# Altium schematic sheet 13. Others.SchDoc
size A4; CheckedBy: 黄钦宁; Author: 陈坤; DocumentNumber: 13; SheetNumber: 13; SheetTotal: 13; PageSetup: Record=PageOptions|CenterHorizontal=True|CenterVertical=True|PrintScale=1.00|XCorrection=1.00|YCorrection=1.00|PrintKind=0|BorderSize=5000000|LeftOffset=0|BottomOffset=0|Orientation=2|PaperLength=1000|PaperWidth=1000|Scale=100|PaperSource=7|PrintQuality=600|MediaType=1|DitherType=10|PaperKind=A4|PrintScaleMode=1; DesignDate: 2013-08-16; CheckDate: 2013-12-28; SheetName: Others; SheetVersion: V1.00; SheetDescription: 复位、模式配置、排针接口; ProductName: EasyARM-iMX28学习套件; ProductModel: EasyARM-iMX283
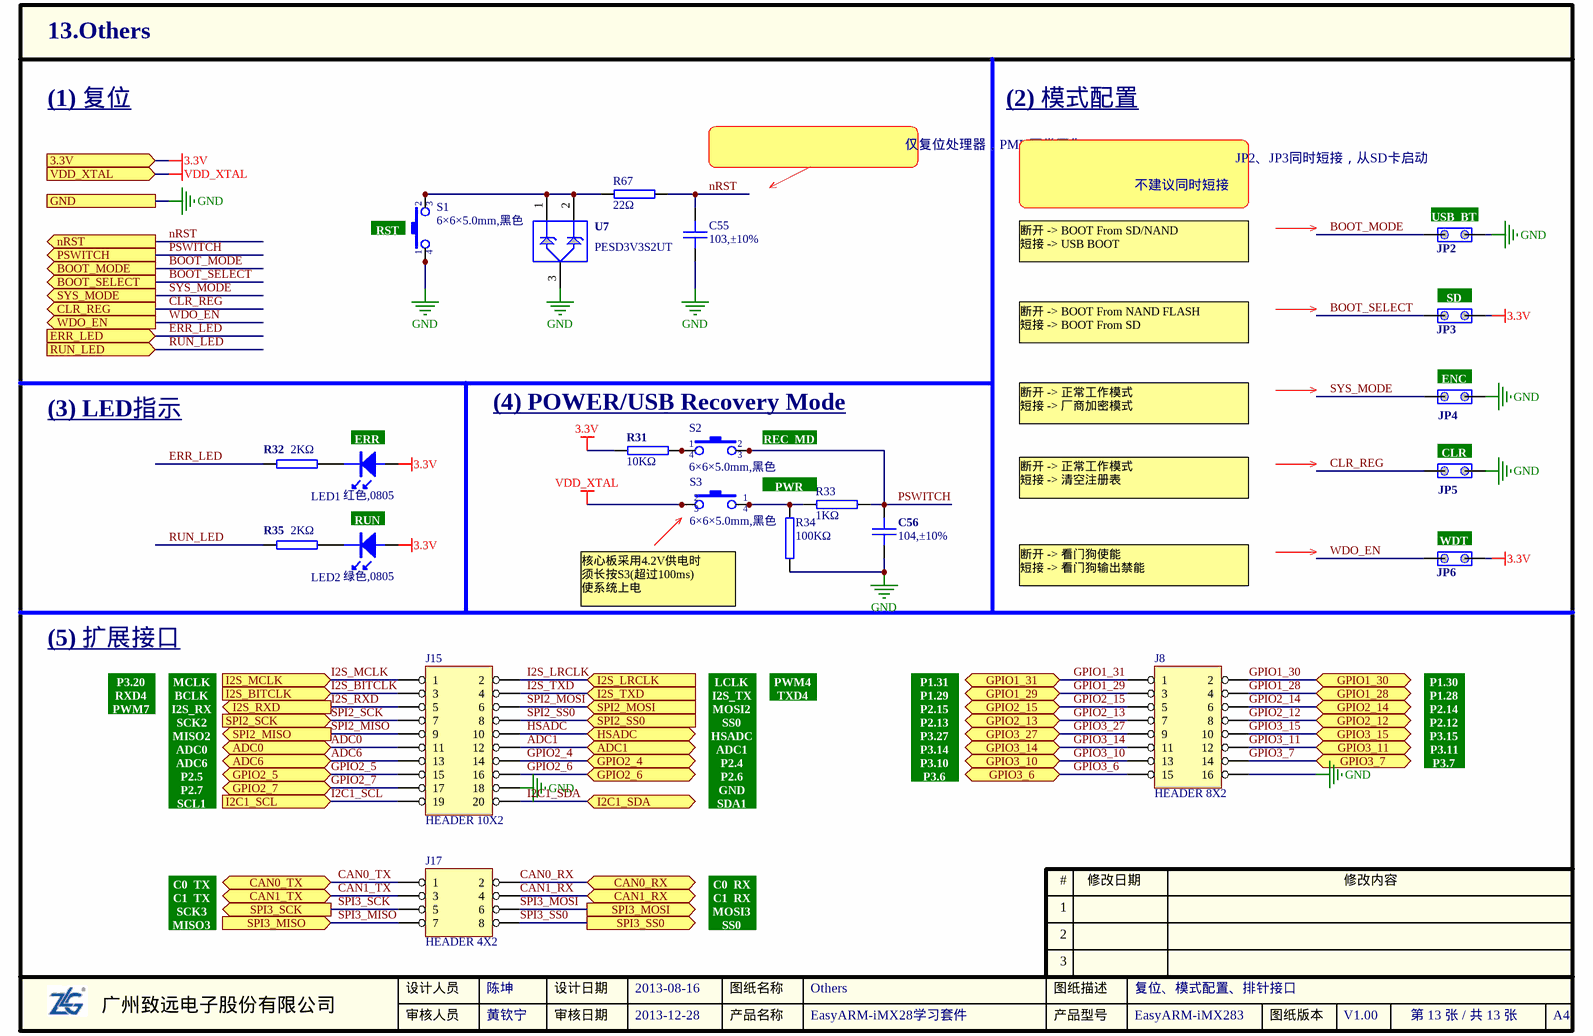
[diagram p0: 13. Others.SchDoc]

## Parts
C55  103,±10%  [0603C]
C56  104,±10%  [0603C]
J8  HEADER 8X2  [IDC-16]
J15  HEADER 10X2  [IDC-20]
J17  HEADER 4X2  [IDC-8]
JP2  120Ω_EN  [SIP-2]  (value not drawn)
JP3  120Ω_EN  [SIP-2]  (value not drawn)
JP4  120Ω_EN  [SIP-2]  (value not drawn)
JP5  120Ω_EN  [SIP-2]  (value not drawn)
JP6  120Ω_EN  [SIP-2]  (value not drawn)
LED1  value 红色,0805  [LED-0805]  (hidden comment: LED1)
LED2  value 绿色,0805  [LED-0805]  (hidden comment: LED1)
R31  10KΩ  [0603R]
R32  2KΩ  [0603R]
R33  1KΩ  [0603R]
R34  100KΩ  [0603R]
R35  2KΩ  [0603R]
R67  22Ω  [0603R]
S1  value 6×6×5.0mm,黑色  [KEY-6S]  (hidden comment: SW-PB4P)
S2  value 6×6×5.0mm,黑色  [KEY-6S]  (hidden comment: SW-PB4P)
S3  value 6×6×5.0mm,黑色  [KEY-6S]  (hidden comment: SW-PB4P)
U7  value PESD3V3S2UT  [SOT-23]  (hidden comment: ESD-3)

## Ports
3.3V, ADC0 (bidir), ADC1 (bidir), ADC6 (bidir), BOOT_MODE (out), BOOT_SELECT (out), CAN0_RX (bidir), CAN0_TX (bidir), CAN1_RX (bidir), CAN1_TX (bidir), CLR_REG (out), ERR_LED (in), GND, GPIO1_28 (bidir), GPIO1_29 (bidir), GPIO1_30 (bidir), GPIO1_31 (bidir), GPIO2_4 (bidir), GPIO2_5 (bidir), GPIO2_6 (bidir), GPIO2_7 (bidir), GPIO2_12 (bidir), GPIO2_13 (bidir), GPIO2_14 (bidir), GPIO2_15 (bidir), GPIO3_6 (bidir), GPIO3_7 (bidir), GPIO3_10 (bidir), GPIO3_11 (bidir), GPIO3_14 (bidir), GPIO3_15 (bidir), GPIO3_27 (bidir), HSADC (bidir), I2C1_SCL (in), I2C1_SDA (bidir), I2S_BITCLK (in), I2S_LRCLK (in), I2S_MCLK (in), I2S_RXD (out), I2S_TXD (in), nRST (out), PSWITCH (out), RUN_LED (in), SPI2_MISO (out), SPI2_MOSI (in), SPI2_SCK (in), SPI2_SS0 (in), SPI3_MISO (in), SPI3_MOSI (out), SPI3_SCK (out), SPI3_SS0 (out), SYS_MODE (out), VDD_XTAL (in), WDO_EN (out)

## Nets
3.3V: JP3.2 JP6.2 LED1.1 LED2.1 R31.1 ; port 3.3V
GND: C55.2 C56.1 J8.16 J15.18 JP2.2 JP4.2 JP5.2 R34.2 S1.1 S1.4 U7.3 ; port GND
VDD_XTAL: S3.2 S3.3 ; port VDD_XTAL
ADC0: J15.11 ; port ADC0
ADC1: J15.12 ; port ADC1
ADC6: J15.13 ; port ADC6
BOOT_MODE: JP2.1 ; port BOOT_MODE
BOOT_SELECT: JP3.1 ; port BOOT_SELECT
CAN0_RX: J17.2 ; port CAN0_RX
CAN0_TX: J17.1 ; port CAN0_TX
CAN1_RX: J17.4 ; port CAN1_RX
CAN1_TX: J17.3 ; port CAN1_TX
CLR_REG: JP5.1 ; port CLR_REG
ERR_LED: R32.1 ; port ERR_LED
GPIO1_28: J8.4 ; port GPIO1_28
GPIO1_29: J8.3 ; port GPIO1_29
GPIO1_30: J8.2 ; port GPIO1_30
GPIO1_31: J8.1 ; port GPIO1_31
GPIO2_4: J15.14 ; port GPIO2_4
GPIO2_5: J15.15 ; port GPIO2_5
GPIO2_6: J15.16 ; port GPIO2_6
GPIO2_7: J15.17 ; port GPIO2_7
GPIO2_12: J8.8 ; port GPIO2_12
GPIO2_13: J8.7 ; port GPIO2_13
GPIO2_14: J8.6 ; port GPIO2_14
GPIO2_15: J8.5 ; port GPIO2_15
GPIO3_6: J8.15 ; port GPIO3_6
GPIO3_7: J8.14 ; port GPIO3_7
GPIO3_10: J8.13 ; port GPIO3_10
GPIO3_11: J8.12 ; port GPIO3_11
GPIO3_14: J8.11 ; port GPIO3_14
GPIO3_15: J8.10 ; port GPIO3_15
GPIO3_27: J8.9 ; port GPIO3_27
HSADC: J15.10 ; port HSADC
I2C1_SCL: J15.19 ; port I2C1_SCL
I2C1_SDA: J15.20 ; port I2C1_SDA
I2S_BITCLK: J15.3 ; port I2S_BITCLK
I2S_LRCLK: J15.2 ; port I2S_LRCLK
I2S_MCLK: J15.1 ; port I2S_MCLK
I2S_RXD: J15.5 ; port I2S_RXD
I2S_TXD: J15.4 ; port I2S_TXD
nRST: C55.1 R67.1 ; port nRST
PSWITCH: C56.2 R33.2 S2.2 S2.3 ; port PSWITCH
RUN_LED: R35.1 ; port RUN_LED
SPI2_MISO: J15.9 ; port SPI2_MISO
SPI2_MOSI: J15.6 ; port SPI2_MOSI
SPI2_SCK: J15.7 ; port SPI2_SCK
SPI2_SS0: J15.8 ; port SPI2_SS0
SPI3_MISO: J17.7 ; port SPI3_MISO
SPI3_MOSI: J17.6 ; port SPI3_MOSI
SPI3_SCK: J17.5 ; port SPI3_SCK
SPI3_SS0: J17.8 ; port SPI3_SS0
SYS_MODE: JP4.1 ; port SYS_MODE
WDO_EN: JP6.1 ; port WDO_EN
NetLED1_2: LED1.2 R32.2
NetLED2_2: LED2.2 R35.2
NetR31_2: R31.2 S2.1 S2.4
NetR33_1: R33.1 R34.1 S3.1 S3.4
NetR67_2: R67.2 S1.2 S1.3 U7.1 U7.2

## Notes on the sheet
- (1) 复位
- (2) 模式配置
- 仅复位处理器，PMU正常工作
- JP2、JP3同时短接，从SD卡启动
- (near S1) RST
- 不建议同时短接
- (near JP2) USB_BT
- 断开 -> BOOT From SD/NAND
  短接 -> USB BOOT
- (near JP3) SD
- 断开 -> BOOT From NAND FLASH
  短接 -> BOOT From SD
- (near JP4) ENC
- (3) LED指示
- (near LED1) ERR
- (4) POWER/USB Recovery Mode
- (near S2) REC_MD
- 断开 -> 正常工作模式
  短接 -> 厂商加密模式
- (near LED2) RUN
- (near R33) PWR
- 断开 -> 正常工作模式
  短接 -> 清空注册表
- (near JP5) CLR
- 断开 -> 看门狗使能
  短接 -> 看门狗输出禁能
- (near JP6) WDT
- (5) 扩展接口
- 核心板采用4.2V供电时
  须长按S3(超过100ms)
  使系统上电
- P3.20
- RXD4
- PWM7
- MCLK
- BCLK
- I2S_RX
- MOSI2
- LCLK
- I2S_TX
- PWM4
- TXD4
- P1.31
- P1.29
- P2.15
- P1.30
- P1.28
- P2.14
- SCK2
- MISO2
- ADC0
- ADC6
- P2.5
- P2.7
- SS0
- HSADC
- ADC1
- P2.4
- P2.6
- GND
- P3.6
- P3.10
- P3.14
- P3.27
- P2.13
- P3.7
- P3.11
- P3.15
- P2.12
- SCL1
- SDA1
- C0_TX
- C1_TX
- SCK3
- MISO3
- C0_RX
- C1_RX
- MOSI3
- 1
- #
- 修改日期
- 修改内容
- 2
- 3
- 广州致远电子股份有限公司
- 设计人员
- 审核人员
- 设计日期
- 审核日期
- 产品名称
- 图纸名称
- 产品型号
- 图纸描述
- 图纸版本
- A4

## Library data of the parts
C55 = 1.02.01.0024: 103,±10%,50V,X7R,0603,*,RoHS; 名称: 电容; 封装: 0603; 设备封装名称: C0603_103_X7R_50V_10%; 贴片和直插: SMT; 物料代码: 1.02.01.0024; Value: 103,±10%; RoHS: RoHS; 型号: 103,±10%,50V,X7R; ComponentLink1Description: ErpDataInfo; ComponentLink1URL: http://erp.zlgmcu.com/ErpExt/ErpData/ListMateriel.aspx?pkey=1.02.01.0024
C56 = 1.02.01.0032: 104,±10%,50V,X7R,0603,*,RoHS; 名称: 电容; 封装: 0603; 设备封装名称: C0603_104_X7R_50V_10%; 贴片和直插: SMT; 物料代码: 1.02.01.0032; Value: 104,±10%; RoHS: RoHS; 型号: 104,±10%,50V,X7R; ComponentLink1Description: ErpDataInfo; ComponentLink1URL: http://erp.zlgmcu.com/ErpExt/ErpData/ListMateriel.aspx?pkey=1.02.01.0032
JP2-JP6 = JMP2
LED1 = 1.04.05.0001: 红色,0805,0805,RoHS; 名称: 发光二极管; 封装: 0805; 设备封装名称: LED0805-RED; 贴片和直插: SMT; 器件优选方案: 优先选用; 物料代码: 1.04.05.0001; RoHS: RoHS; 型号: 红色,0805; ComponentLink1Description: ErpDataInfo; ComponentLink1URL: http://erp.zlgmcu.com/ErpExt/ErpData/ListMateriel.aspx?pkey=1.04.05.0001
LED2 = 1.04.05.0002: 绿色,0805,0805,RoHS; 名称: 发光二极管; 封装: 0805; 设备封装名称: LED0805-GREEN; 贴片和直插: SMT; 器件优选方案: 优先选用; 物料代码: 1.04.05.0002; RoHS: RoHS; 型号: 绿色,0805; ComponentLink1Description: ErpDataInfo; ComponentLink1URL: http://erp.zlgmcu.com/ErpExt/ErpData/ListMateriel.aspx?pkey=1.04.05.0002
R31 = 1.01.01.0051: 10KΩ,0603,*,RoHS; 名称: 电阻; 封装: 0603; 设备封装名称: R0603_10K; 贴片和直插: SMT; 物料代码: 1.01.01.0051; Value: 10KΩ; RoHS: RoHS; 型号: 10KΩ; ComponentLink1Description: ErpDataInfo; ComponentLink1URL: http://erp.zlgmcu.com/ErpExt/ErpData/ListMateriel.aspx?pkey=1.01.01.0051
R32 R35 = 1.01.01.0038: 2KΩ,0603,*,RoHS; 名称: 电阻; 封装: 0603; 设备封装名称: R0603_2K; 贴片和直插: SMT; 物料代码: 1.01.01.0038; Value: 2KΩ; RoHS: RoHS; 型号: 2KΩ; ComponentLink1Description: ErpDataInfo; ComponentLink1URL: http://erp.zlgmcu.com/ErpExt/ErpData/ListMateriel.aspx?pkey=1.01.01.0038
R33 = 1.01.01.0035: 1KΩ,0603,*,RoHS; 名称: 电阻; 封装: 0603; 设备封装名称: R0603_1K; 贴片和直插: SMT; 物料代码: 1.01.01.0035; Value: 1KΩ; RoHS: RoHS; 型号: 1KΩ; ComponentLink1Description: ErpDataInfo; ComponentLink1URL: http://erp.zlgmcu.com/ErpExt/ErpData/ListMateriel.aspx?pkey=1.01.01.0035
R34 = 1.01.01.0062: 100KΩ,0603,*,RoHS; 名称: 电阻; 封装: 0603; 设备封装名称: R0603_100K; 贴片和直插: SMT; 物料代码: 1.01.01.0062; Value: 100KΩ; RoHS: RoHS; 型号: 100KΩ; ComponentLink1Description: ErpDataInfo; ComponentLink1URL: http://erp.zlgmcu.com/ErpExt/ErpData/ListMateriel.aspx?pkey=1.01.01.0062
R67 = 1.01.01.0014: 名称: 电阻; 规格型号: 22Ω,0603,*,RoHS; 封装: 0603; 设备封装名称: R0603_22R; 贴片和直插: SMT; 物料代码: 1.01.01.0014; Value: 22Ω; RoHS: RoHS; ComponentLink1Description: ErpDataInfo; ComponentLink1URL: http://erp.zlgmcu.com/ErpExt/ErpData/ListMateriel.aspx?pkey=1.01.01.0014; 型号: 22Ω
S1-S3 = 1.09.01.0003: 6×6×5.0mm,黑色,SMD,,*; 名称: 轻触按键; 贴片和直插: SMT; 物料代码: 1.09.01.0003; 型号: 6×6×5.0mm,黑色,SMD; ComponentLink1Description: ErpDataInfo; ComponentLink1URL: http://erp.zlgmcu.com/ErpExt/ErpData/ListMateriel.aspx?pkey=1.09.01.0003
U7 = 1.05.10.0361: ESD单向; 名称: IC; 规格型号: PESD3V3S2UT,SOT-23,NXP,RoHS; 设备封装名称: SOT-23_PESD3V3S2UT; 厂商: NXP; 贴片和直插: SMT; PCB备注: 没有数据手册; 现有库存: 5276; 物料代码: 1.05.10.0361; 封装: SOT-23; RoHS: RoHS; ComponentLink1Description: ErpDataInfo; ComponentLink1URL: http://erp.zlgmcu.com/ErpExt/ErpData/ListMateriel.aspx?pkey=1.05.10.0361